# Altium schematic sheet Dimer_Power_Board.SchDoc: Багатоканальний пристрій регулювавання потужності
size 420 x 297 mm; CheckedBy: Хоменко М.А.; Author: Шокодько Д.А.; CompanyName: НУЧП; DocumentNumber: МРА.ЕН 14194617; Revision: Хоменко М.А.; SheetNumber: 2; SheetTotal: 4; Scale: 1:1; Title2str: електричних нагрівальних елементів; DocumentType: Схема електрична принципова; FirstReferrence: АБВГ.123456.001; T_Contr: Хоменко М.А.; N_Contr: Хоменко М.А.
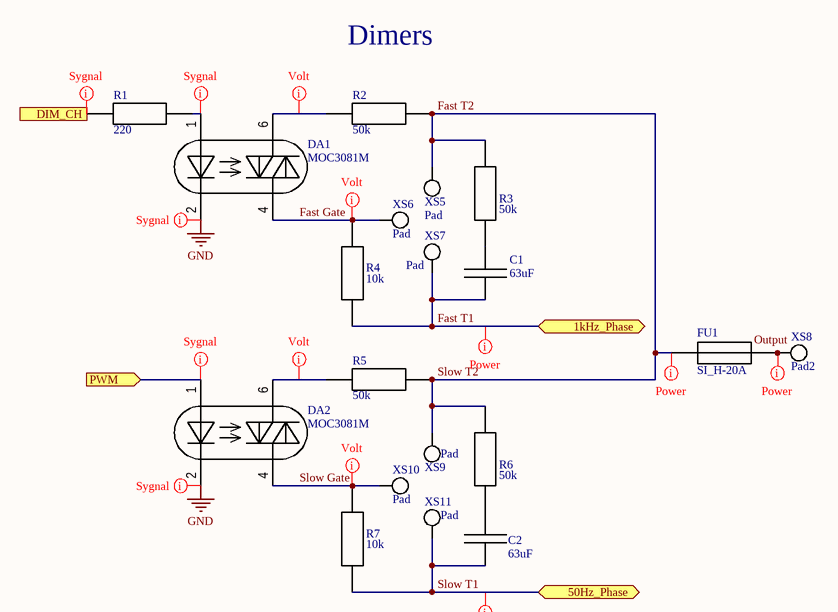
[diagram p0: Dimer_Power_Board.SchDoc]

## Parts
C1  63uF  [C-15]
C2  63uF  [C-15]
DA1  MOC3081M  [DIL-06]
DA2  MOC3081M  [DIL-06]
FU1  SI_H-20A  [SI_H-20A_]
R1  220  [RESC2012X06N]
R2  50k  [R-15]
R3  50k  [R-15]
R4  10k  [R-10]
R5  50k  [R-15]
R6  50k  [R-15]
R7  10k  [R-10]
XS5  Pad  [LOTPAD]
XS6  Pad  [LOTPAD]
XS7  Pad  [LOTPAD]
XS8  Pad2  [LOTPAD_2]
XS9  Pad  [LOTPAD]
XS10  Pad  [LOTPAD]
XS11  Pad  [LOTPAD]

## Ports
1kHz_Phase (bidir), 50Hz_Phase (bidir), DIM_CH (in), PWM (in)

## Nets
GND: DA1.2(Cathode) DA2.2(Cathode)
DIM_CH: R1.1 ; port DIM_CH
Fast Gate: DA1.4(Main_terminal) R4.2 XS6.1
Fast T1: C1.1 R4.1 XS7.1 ; port 1kHz_Phase
Fast T2: FU1.3 R2.2 R3.2 R5.2 R6.2 XS5.1 XS9.1  [also labelled Slow T2]
PWM: DA2.1(Anode) ; port PWM
Slow Gate: DA2.4(Main_terminal) R7.2 XS10.1
Slow T1: C2.1 R7.1 XS11.1 ; port 50Hz_Phase
NetC1_2: C1.2 R3.1
NetC2_2: C2.2 R6.1
NetDA1_1: DA1.1(Anode) R1.2
NetDA1_6: DA1.6(Main_terminal) R2.1
NetDA2_6: DA2.6(Main_terminal) R5.1
NetFU1_2: FU1.2 XS8.1 XS8.2

## Layout directives
net class Sygnal; rule Width Constraint [Pref Width = 0.45mm    Min Width = 0.25mm    Max Width = 0.6mm]; rule Clearance Constraint [Clearance = 0.4mm]: DIM_CH, GND, NetDA1_1, PWM
net class Volt; rule Width Constraint [Pref Width = 0.7mm    Min Width = 0.4mm    Max Width = 1mm]; rule Clearance Constraint [Clearance = 3mm]: Fast Gate, NetDA1_6, NetDA2_6, Slow Gate
net class High Cur Volt; rule Width Constraint [Pref Width = 3.5mm    Min Width = 1.5mm    Max Width = 12mm]; rule Clearance Constraint [Clearance = 3mm]: Fast T1, Fast T2, NetFU1_2, Slow T1

## Notes on the sheet
- Dimers
- Labels drawn without touching a wire or pin: Output
- Перше використання
- Довідн. №
- Підп. і дата
- Інв. № дубл.
- Взамін інв. №
- Розроб.
- Зм.
- Лист
- № докум.
- Підп.
- Дата
- Літ.
- Маса
- Масштаб
- Перевір.
- Т.контр.
- Листів
- Інв. № оригін.
- Затв.
- Н.контр.
- 2.106-A3
- Формат А3

## Library data of the parts
C1 C2 = C_15: Value: *
DA1 DA2 = MOC3081M: MOC3081M Optosimistor Driver; ClassName: VS
FU1 = Fuse SI_H-20A: ClassName: FU
R1 = 220: Resistor
R2 R3 R5 R6 = Res_15: Value: *
R4 R7 = Res_10: Value: *
XS5-XS7 XS9-XS11 = Pad: PCB TH Pad
XS8 = Pad2: PCB TH Pad